# Altium project Voltage_distribution.PrjPcb
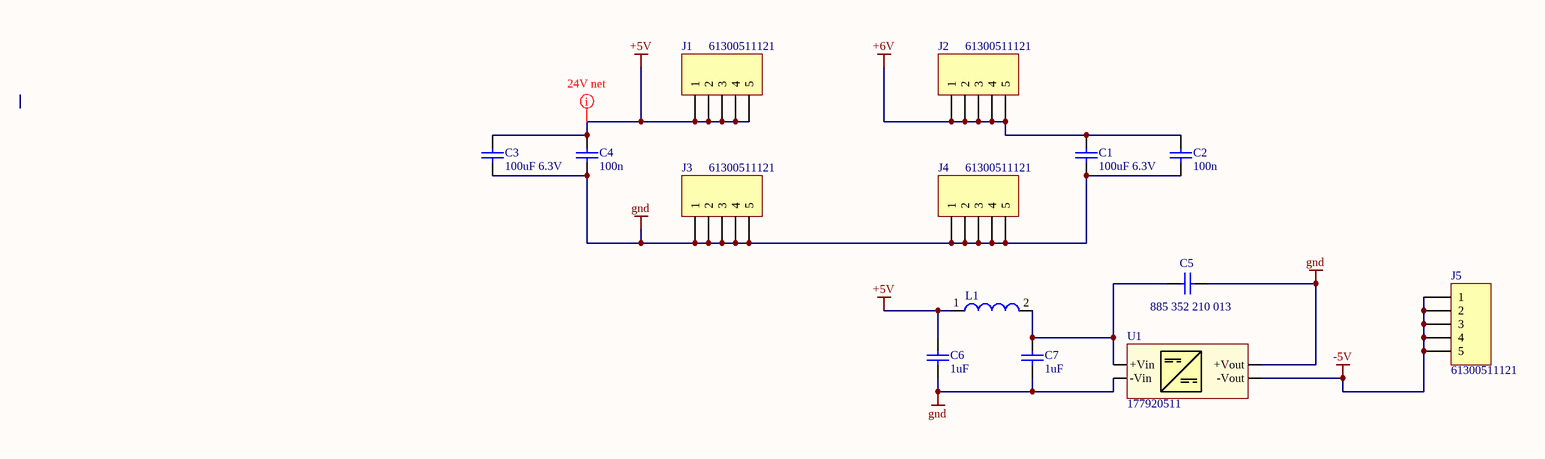
[diagram p0: Sheet1.SchDoc]
1 sheet, 14 parts. Net scope: global (net labels, ports and power ports of the same name join across sheets).
Board file: board.PcbDoc

## Sheet Sheet1.SchDoc
size A4

### Parts
C1  100uF 6.3V  [CAPC1206(3216)190_L]
C2  100n  [CAPC2013X88X50ML20T25]
C3  100uF 6.3V  [CAPC1206(3216)190_L]
C4  100n  [CAPC2013X88X50ML20T25]
C5  885 352 210 013  [CAPC1808(4520)215_M]
C6  1uF  [CAPC1206(3216)190_N]
C7  1uF  [CAPC1206(3216)190_N]
J1  61300511121  [61300411121]
J2  61300511121  [61300411121]
J3  61300511121  [61300411121]
J4  61300511121  [61300411121]
J5  61300511121  [61300411121]
L1  WE - 744773168  [WE-PD2-S]  (value not drawn)
U1  177920511  [WE-FSIM-SIP-4]

### Nets
+5V: C3.2 C4.2 C6.2 J1.1 J1.2 J1.3 J1.4 J1.5 L1.1
+6V: C1.2 C2.2 J2.1 J2.2 J2.3 J2.4 J2.5
-5V: J5.1 J5.2 J5.3 J5.4 J5.5 U1.3(-Vout)
gnd: C1.1 C2.1 C3.1 C4.1 C5.2 C6.1 C7.1 J3.1 J3.2 J3.3 J3.4 J3.5 J4.1 J4.2 J4.3 J4.4 J4.5 U1.1(-Vin) U1.4(+Vout)
NetC5_1: C5.1 C7.2 L1.2 U1.2(+Vin)

### Layout directives
net class 24V_net: +5V

### Library data of the parts
C1 C3 = CMP-00469-1: CAP 100uF 6.3V ±20% 1206 (3216 Metric) Thickness 1.9mm SMD; Tolerance: Â±20%; Case-EIA: 1206; Case-Metric: 3216; Technology: SMT; Max Thickness: 1.9 mm; Rated Voltage: 6.3 V; Value: 100uF
C2 C4 = CMP-001-0082-2: generic 0805 COG oder X7R Vielschichtkondensatoren max. +/-10%
C5 = CMP-001-0032-3: 1,0nF  1808  250V; Manufacturer: Wurth Electronics Inc.; Capacitance: 1000pF; Ratings: X1, Y2; Temperature Coefficient: X7R; Tolerance: ±10%; Voltage - Rated: 250VAC; Applications: Safety; ComponentLink1Description: 885352210013.pdf; ComponentLink1URL: http://katalog.we-online.de/pbs/datasheet/885352210013.pdf; Lead Style: -; Mounting Type: Surface Mount, MLCC; Operating Temperature: -55°C ~ 125°C; Package / Case: 1808 (4520 Metric); Packaging: Tape & Reel (TR); Part Status: Active; Size / Dimension: 0.177" L x 0.079" W (4.50mm x 2.00mm); Supplier: Digi-Key; Supplier Part Number: 732-10341-2-ND; Thickness (Max): 0.087" (2.20mm); PartNumber: 885 352 210 013; Features: -; Height - Seated (Max): -; Lead Spacing: -
C6 C7 = CMP-001-0138-A.1: CAP CER 1UF 10V X7R 1206; Manufacturer: Wurth Electronics Inc.; Manufacturer Part Number: 885012208013; Notification: Current market demand for these product types have resulted in fluctuating and extending lead times. Lead times may differ.; Tolerance: ±10%; Applications: General Purpose; ComponentLink1Description: 885012208013.pdf; ComponentLink1URL: http://katalog.we-online.de/pbs/datasheet/885012208013.pdf; Features: -; Height - Seated (Max): -; Lead Spacing: -; Lead Style: -; Mounting Type: Surface Mount, MLCC; Operating Temperature: -55°C ~ 125°C; Package / Case: 1206 (3216 Metric); Packaging: Cut Tape (CT); Part Status: Active; Ratings: -; Size / Dimension: 0.126" L x 0.063" W (3.20mm x 1.60mm); Supplier: Digi-Key; Supplier Part Number: 732-7685-1-ND; Temperature Coefficient: X7R; Thickness (Max): 0.051" (1.30mm); Voltage - Rated: 10V
J1-J5 = CMP-001-0074-1: 5Pol; gerade; WR-PHD 2.54 mm THT Pin Header; Brand: Wurth Electronics; Current Rating: 3 A; Insulation Resistance: 1 GOhms; Mating Post Length: 6 mm; Mounting Angle: Straight; Number of Positions: 5 Position; Pitch: 2.54 mm; ComponentLink1Description: 6130xx11121-538006.pdf; ComponentLink1URL: http://www.mouser.com/ds/2/445/6130xx11121-538006.pdf; Contact Gender: Pin (Male); Contact Material: Copper Alloy; Contact Plating: Gold; Contact Type: -; Flammability Rating: UL 94 V-0; Housing Gender: -; Housing Material: Polyamide (PA); Manufacturer: Wurth Electronics; Manufacturer Part Number: 61300511121; Minimum Order Quantity: 1; Mounting Style: Straight Pin; Number of Rows: 1 Row; Packaging: Bulk; Product: Headers; Reeling: False; RoHS - Mouser: Y; Row Spacing: -; Series: WR-PHD; Standard Pack Qty: 1000; Supplier: Mouser; Supplier Part Number: 710-61300511121; Termination Post Length: 3 mm; Termination Style: Through Hole; Type: Pin Strip; PartNumber: 61300511121
L1 = CMP-001-0054-3: WE-PD2 SMD-Speicherdrossel; 68uH; 0,68A; L = 68 μH ±10%; IR = 0.56A; Isat = 0.68 A; RDC = 1.117 Ω; Manufacturer: Wurth Electronics; Inductance: 68.0 ÂµH; ComponentLink1Description: Manufacturer Link; ComponentLink1URL: http://www.we-online.com; ComponentLink2Description: Datasheet; ComponentLink2URL: http://www.we-online.de/katalog/media/pdf/744773168.pdf; DatasheetVersion: ver 1, Oct-2004; PackageDescription: SMD Inductor, 2-Leads, Body 4.5 x 4.0 mm; PackageReference: WE-PD2-S; PackageVersion: 2004; PartNumber: 744773168
U1 = CMP-001-0110-A.2: FISM Fisxed Isolated Module 177 920 511 Isolierte SIP Modul mit fixem Ausgang, DC/DC converter, 5Vin 5Vout, 200mA; Manufacturer: Wurth Electronics Inc.; Efficiency: 79%; Number of Outputs: 1; Power (Watts): 1W; Voltage - Input (Max): 5.5V; Voltage - Input (Min): 4.5V; Voltage - Isolation: 1kV (1000V); Voltage - Output 1: 5V; Applications: ITE (Commercial); ComponentLink1Description: 177920511.pdf; ComponentLink1URL: http://katalog.we-online.de/pm/datasheet/177920511.pdf; Current - Output (Max): 200mA; Features: -; Manufacturer Part Number: 177920511; Mounting Type: Through Hole; Operating Temperature: -40°C ~ 85°C; Package / Case: 4-SIP Module; Packaging: Tube; Part Status: Active; Size / Dimension: 0.45" L x 0.24" W x 0.39" H (11.5mm x 6.0mm x 10.0mm); Supplier: Digi-Key; Supplier Device Package: -; Supplier Part Number: 732-10876-ND; Type: Isolated Module; Voltage - Output 2: -; Voltage - Output 3: -; PartNumber: 177 920 511